# EAGLE schematic RS232-TTL (EAGLE 9.6.2)
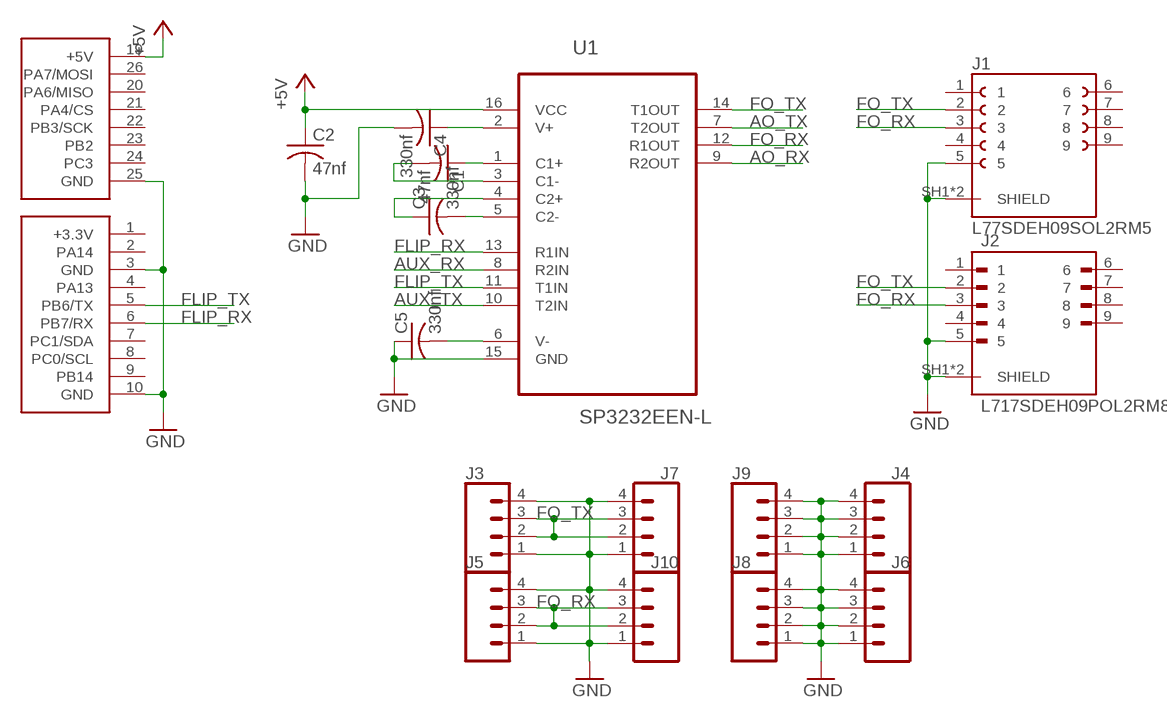
[diagram p0: schematic, sheet 1]

## Parts
C1  47nf  C-USC0805  [C0805]
C2  47nf  C-USC0805  [C0805]
C3  330nf  C-USC0805  [C0805]
C4  330nf  C-USC0805  [C0805]
C5  330nf  C-USC0805  [C0805]
J1  L77SDEH09SOL2RM5  [AMPHENOL_L77SDEH09SOL2RM5]
J2  L717SDEH09POL2RM8  [AMPHENOL_L717SDEH09POL2RM8]
J3  CONN_04SMD_VERTICAL_MALE  [1X04_SMD_VERTICAL_COMBO_CENTERED]
J4  CONN_04SMD_VERTICAL_MALE  [1X04_SMD_VERTICAL_COMBO_CENTERED]
J5  CONN_04SMD_VERTICAL_MALE  [1X04_SMD_VERTICAL_COMBO_CENTERED]
J6  CONN_04SMD_VERTICAL_MALE  [1X04_SMD_VERTICAL_COMBO_CENTERED]
J7  CONN_04PTH  [1X04]
J8  CONN_04PTH  [1X04]
J9  CONN_04PTH  [1X04]
J10  CONN_04PTH  [1X04]
U1  SP3232EEN-L  [SOIC127P600X175-16N]
U$1  BOTH-SMD  [BOTH-SMD]

## Nets
+5V: C2.1 U1.16(VCC) U$1.19(+5V)
AO_RX: U1.9(R2OUT)
AO_TX: U1.7(T2OUT)
AUX_RX: U1.8(R2IN)
AUX_TX: U1.10(T2IN)
FLIP_RX: U1.13(R1IN) U$1.6(PB7/RX)
FLIP_TX: U1.11(T1IN) U$1.5(PB6/TX)
FO_RX: J1.3 J2.3 J5.2 J5.3 J10.2 J10.3 U1.12(R1OUT)
FO_TX: J1.2 J2.2 J3.2 J3.3 J7.2 J7.3 U1.14(T1OUT)
GND: C2.2 C4.2 C5.1 J1.5 J1.SH1(SHIELD) J1.SH2(SHIELD) J2.5 J2.SH1(SHIELD) J2.SH2(SHIELD) J3.1 J3.4 J4.1 J4.2 J4.3 J4.4 J5.1 J5.4 J6.1 J6.2 J6.3 J6.4 J7.1 J7.4 J8.1 J8.2 J8.3 J8.4 J9.1 J9.2 J9.3 J9.4 J10.1 J10.4 U1.15(GND) U$1.3(GND) U$1.10(GND) U$1.25(GND)
N$1: C4.1 U1.2(V+)
N$2: C1.1 U1.1(C1+)
N$3: C3.2 U1.5(C2-)
N$4: C3.1 U1.4(C2+)
N$5: C1.2 U1.3(C1-)
N$8: C5.2 U1.6(V-)
Unconnected: J1.1 J1.4 J1.6 J1.7 J1.8 J1.9 J2.1 J2.4 J2.6 J2.7 J2.8 J2.9 U$1.1(+3.3V) U$1.2(PA14) U$1.4(PA13) U$1.7(PC1/SDA) U$1.8(PC0/SCL) U$1.9(PB14) U$1.20(PA6/MISO) U$1.21(PA4/CS) U$1.22(PB3/SCK) U$1.23(PB2) U$1.24(PC3) U$1.26(PA7/MOSI)

## Library data of the parts
C1-C5 = rcl:C-US: CAPACITOR, American symbol; SPICEPREFIX: C
J1 = L77SDEH09SOL2RM5:L77SDEH09SOL2RM5; CHECK_PRICES: https://www.snapeda.com/parts/L77SDEH09SOL2RM5/Amphenol/view-part/?ref=eda; DESCRIPTION: Dsub, Stamped Signal 3A, Straight PCB Thru Hole, 09 Socket, Flash Gold, Bright Tin Shell, 4-40 Threaded Standoff 6.0mm (0.236in), With Boardlock 4.2mm (0.165in); DIGIKEY_PART_NUMBER: L77SDEH09SOL2RM5-ND; MF: Amphenol ICC; MP: L77SDEH09SOL2RM5; PACKAGE: None; SNAPEDA_LINK: https://www.snapeda.com/parts/L77SDEH09SOL2RM5/Amphenol/view-part/?ref=snap
J2 = L717SDEH09POL2RM8:L717SDEH09POL2RM8; CHECK_PRICES: https://www.snapeda.com/parts/L717SDEH09POL2RM8/Amphenol/view-part/?ref=eda; DESCRIPTION: Dsub, Stamped Signal 3A, Straight PCB Thru Hole, 09 Pin, Flash Gold, Bright Tin Shell+Grounding Dimples, 4-40 Removable Front Screwlock, Standoff 6.0mm (0.236in), With Boardlock 4.2mm (0.165in); DIGIKEY_PART_NUMBER: L717SDEH09POL2RM8-ND; MF: Amphenol ICC; MP: L717SDEH09POL2RM8; PACKAGE: None; SNAPEDA_LINK: https://www.snapeda.com/parts/L717SDEH09POL2RM8/Amphenol/view-part/?ref=snap
J3-J6 = SparkFun-Connectors:CONN_04: Multi connection point. Often used as Generic Header-pin footprint for 0.1 inch spaced/style header connections On any of the 0.1 inch spaced packages, you can populate with these: Break Away Headers - Straight <https://www.sparkfun.com/products/116> (PRT-00116) Break Away Male Headers - Right Angle <https://www.sparkfun.com/products/553> (PRT-00553) Female Headers <https://www.sparkfun.com/products/115> (PRT-00115) Break Away Headers - Machine Pin <https://www.sparkfun.com/products/117> (PRT-00117) Break Away Female Headers - Swiss Machine Pin <https://www.sparkfun.com/products/743> (PRT-00743) For SCREWTERMINALS and SPRING TERMINALS visit here: Screw Terimnals on SparkFun.com <https://www.sparkfun.com/search/results?term=Screw+Terminals> (5mm/3.5mm/2.54mm spacing) This device is also useful as a general connection point to wire up your design to another part of your project. Our various solder wires solder well into these plated through hole pads. Hook-Up Wire - Assortment (Stranded, 22 AWG) <https://www.sparkfun.com/products/11375> (PRT-11375) Hook-Up Wire - Assortment (Solid Core, 22 AWG) <https://www.sparkfun.com/products/11367> (PRT-11367) View the entire wire category on our website here <https://www.sparkfun.com/categories/141> Special notes: Molex polarized connector foot print use with SKU : PRT-08231 with associated crimp pins and housings. 1MM SMD Version SKU: PRT-10208; PROD_ID: CONN-17242
J7-J10 = SparkFun-Connectors:CONN_04: Multi connection point. Often used as Generic Header-pin footprint for 0.1 inch spaced/style header connections On any of the 0.1 inch spaced packages, you can populate with these: Break Away Headers - Straight <https://www.sparkfun.com/products/116> (PRT-00116) Break Away Male Headers - Right Angle <https://www.sparkfun.com/products/553> (PRT-00553) Female Headers <https://www.sparkfun.com/products/115> (PRT-00115) Break Away Headers - Machine Pin <https://www.sparkfun.com/products/117> (PRT-00117) Break Away Female Headers - Swiss Machine Pin <https://www.sparkfun.com/products/743> (PRT-00743) For SCREWTERMINALS and SPRING TERMINALS visit here: Screw Terimnals on SparkFun.com <https://www.sparkfun.com/search/results?term=Screw+Terminals> (5mm/3.5mm/2.54mm spacing) This device is also useful as a general connection point to wire up your design to another part of your project. Our various solder wires solder well into these plated through hole pads. Hook-Up Wire - Assortment (Stranded, 22 AWG) <https://www.sparkfun.com/products/11375> (PRT-11375) Hook-Up Wire - Assortment (Solid Core, 22 AWG) <https://www.sparkfun.com/products/11367> (PRT-11367) View the entire wire category on our website here <https://www.sparkfun.com/categories/141> Special notes: Molex polarized connector foot print use with SKU : PRT-08231 with associated crimp pins and housings. 1MM SMD Version SKU: PRT-10208; PROD_ID: CONN-09696
U1 = SP3232EEN-L:SP3232EEN-L: RS-232 Transceivers Check availability <https://pricing.snapeda.com/parts/SP3232EEN-L/MaxLinear%2C%20Inc./view-part?ref=eda>; AVAILABILITY: In Stock; CHECK_PRICES: https://www.snapeda.com/parts/SP3232EEN-L/MaxLinear/view-part/?ref=eda; DESCRIPTION: 2/2 Transceiver Full RS232 16-SOIC; MF: MaxLinear, Inc.; MP: SP3232EEN-L; PACKAGE: SOIC-16 Exar; PRICE: None; SNAPEDA_LINK: https://www.snapeda.com/parts/SP3232EEN-L/MaxLinear/view-part/?ref=snap
U$1 = Flipper-Zero-GPIO-Headers:BOTH-SMD